# EAGLE design Shruthi-Analog-SVF-v01c (EAGLE 5.09)
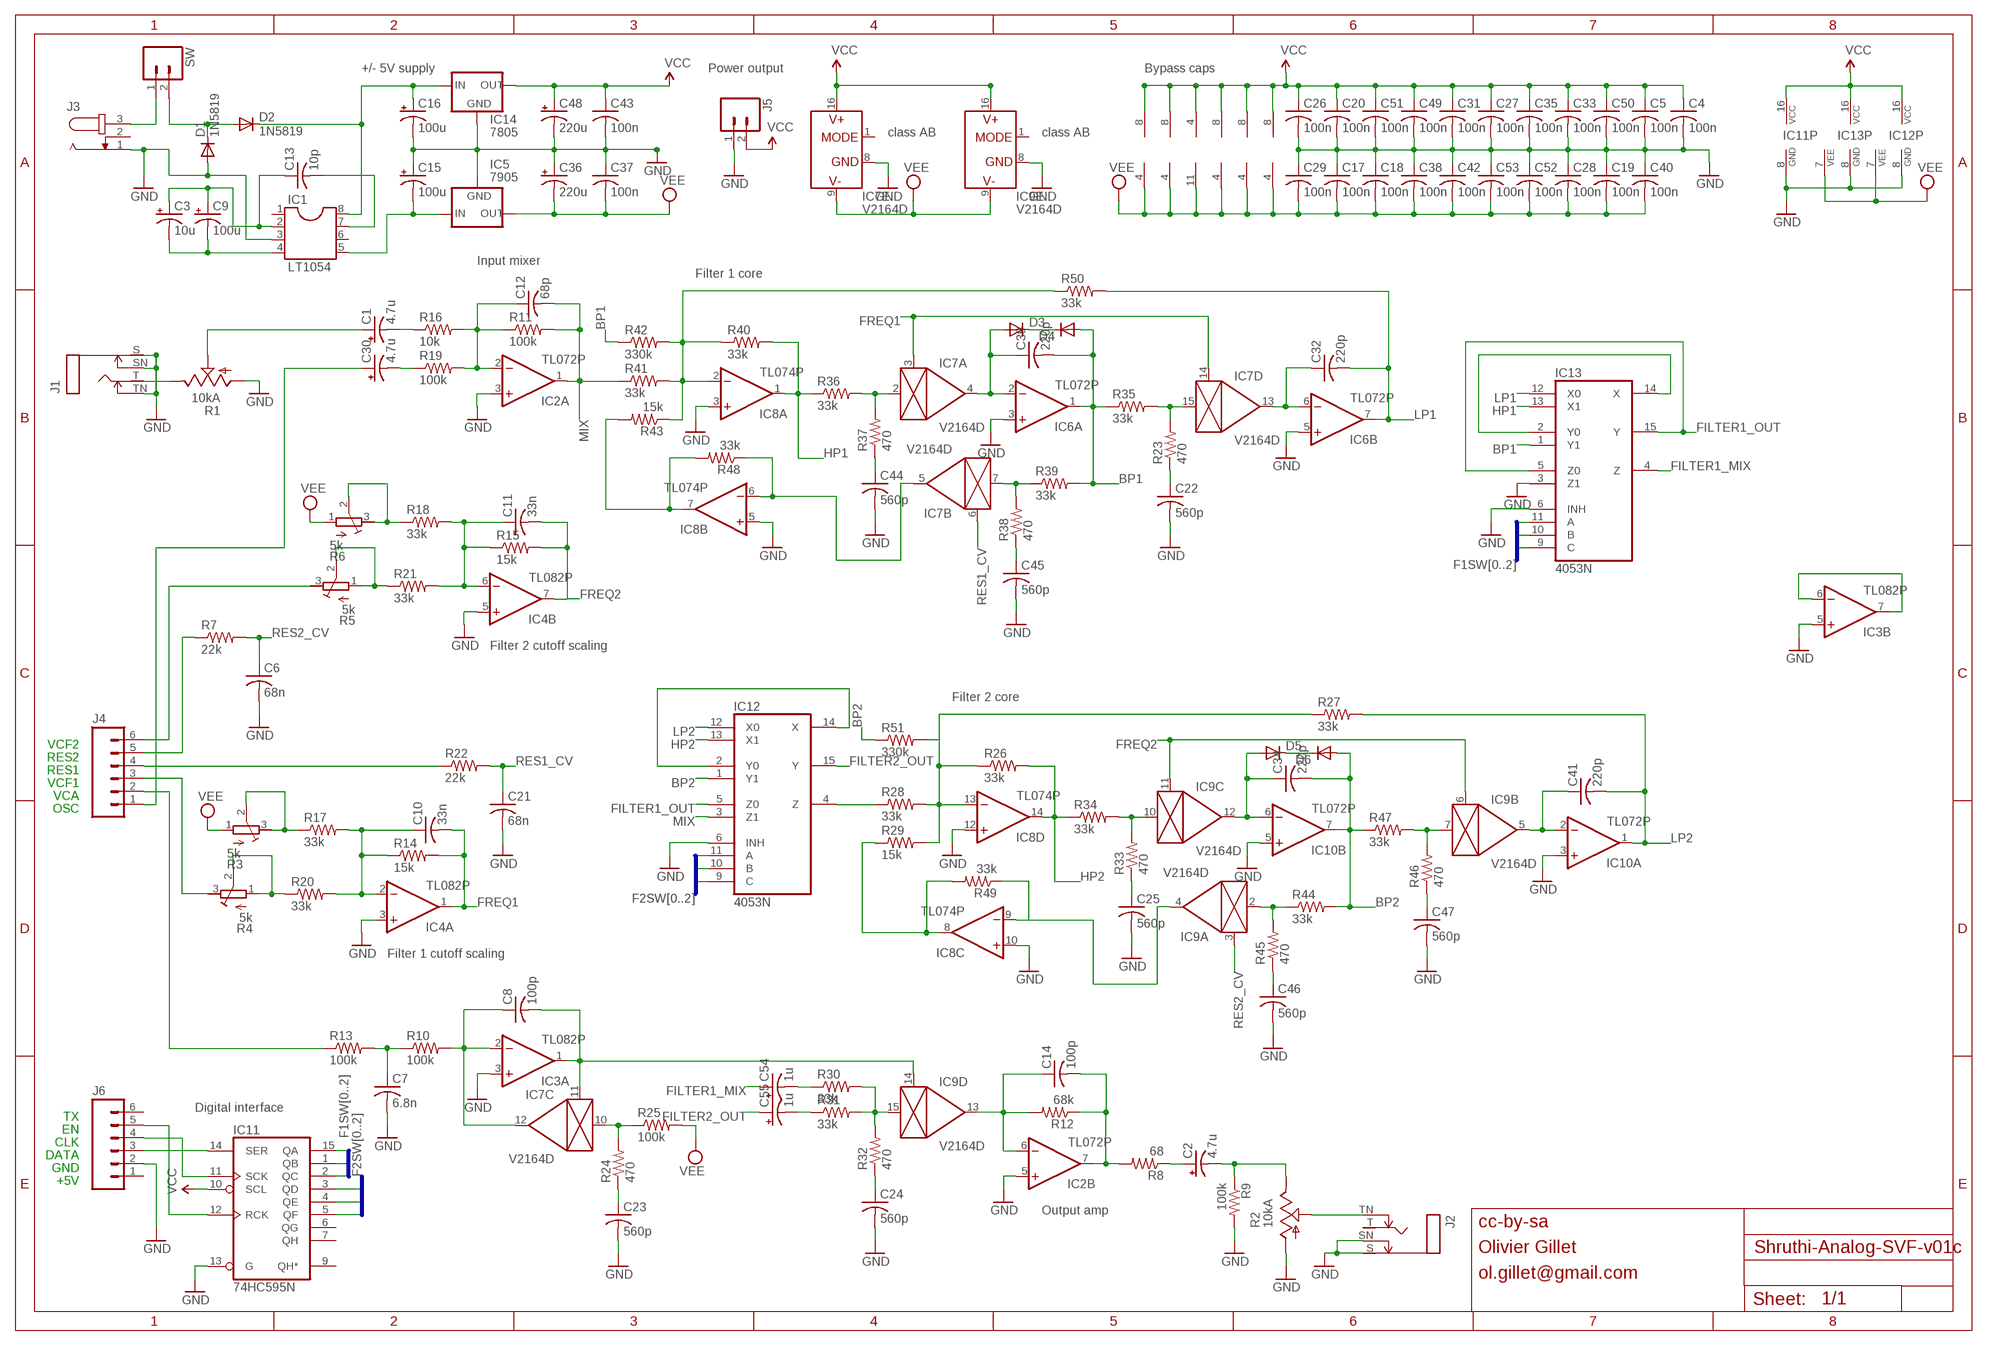
[diagram p0: schematic, sheet 1]

## Parts
C1  4.7u  CPOL-USE2.5-6  [E2,5-6]
C2  4.7u  CPOL-USE2.5-6  [E2,5-6]
C3  10u  CPOL-USE2.5-5  [E2,5-5]
C4  100n  C-US025-025X050  [C025-025X050]
C5  100n  C-US025-025X050  [C025-025X050]
C6  68n  C-US050-025X075  [C050-025X075]
C7  6.8n  C-US025-025X050  [C025-025X050]
C8  100p  C-US025-025X050  [C025-025X050]
C9  100u  CPOL-USE2.5-6  [E2,5-6]
C10  33n  C-US050-025X075  [C050-025X075]
C11  33n  C-US050-025X075  [C050-025X075]
C12  68p  C-US025-025X050  [C025-025X050]
C13  10p  C-US025-025X050  [C025-025X050]
C14  100p  C-US025-025X050  [C025-025X050]
C15  100u  CPOL-USE2.5-7  [E2,5-7]
C16  100u  CPOL-USE2.5-7  [E2,5-7]
C17  100n  C-US025-025X050  [C025-025X050]
C18  100n  C-US025-025X050  [C025-025X050]
C19  100n  C-US025-025X050  [C025-025X050]
C20  100n  C-US025-025X050  [C025-025X050]
C21  68n  C-US050-025X075  [C050-025X075]
C22  560p  C-US025-025X050  [C025-025X050]
C23  560p  C-US025-025X050  [C025-025X050]
C24  560p  C-US025-025X050  [C025-025X050]
C25  560p  C-US025-025X050  [C025-025X050]
C26  100n  C-US025-025X050  [C025-025X050]
C27  100n  C-US025-025X050  [C025-025X050]
C28  100n  C-US025-025X050  [C025-025X050]
C29  100n  C-US025-025X050  [C025-025X050]
C30  4.7u  CPOL-USE2.5-6  [E2,5-6]
C31  100n  C-US025-025X050  [C025-025X050]
C32  220p  C-US025-025X050  [C025-025X050]
C33  100n  C-US025-025X050  [C025-025X050]
C34  220p  C-US025-025X050  [C025-025X050]
C35  100n  C-US025-025X050  [C025-025X050]
C36  220u  CPOL-USE5-10.5  [E5-10,5]
C37  100n  C-US025-025X050  [C025-025X050]
C38  100n  C-US025-025X050  [C025-025X050]
C39  220p  C-US025-025X050  [C025-025X050]
C40  100n  C-US025-025X050  [C025-025X050]
C41  220p  C-US025-025X050  [C025-025X050]
C42  100n  C-US025-025X050  [C025-025X050]
C43  100n  C-US025-025X050  [C025-025X050]
C44  560p  C-US025-025X050  [C025-025X050]
C45  560p  C-US025-025X050  [C025-025X050]
C46  560p  C-US025-025X050  [C025-025X050]
C47  560p  C-US025-025X050  [C025-025X050]
C48  220u  CPOL-USE5-10.5  [E5-10,5]
C49  100n  C-US025-025X050  [C025-025X050]
C50  100n  C-US025-025X050  [C025-025X050]
C51  100n  C-US025-025X050  [C025-025X050]
C52  100n  C-US025-025X050  [C025-025X050]
C53  100n  C-US025-025X050  [C025-025X050]
C54  1u  CPOL-USE2.5-5  [E2,5-5]
C55  1u  CPOL-USE2.5-5  [E2,5-5]
D1  1N5819  1N4004  [DO41-10]
D2  1N5819  1N4004  [DO41-10]
D3  DIODE-D-5  [D-5]
D4  DIODE-D-5  [D-5]
D5  DIODE-D-5  [D-5]
D6  DIODE-D-5  [D-5]
IC1  LT1054  DIL8  [DIL08]
IC2  TL072P  [DIL08]
IC3  TL082P  TL072P  [DIL08]
IC4  TL082P  TL072P  [DIL08]
IC5  7905  79XXS  [79XXS]
IC6  TL072P  [DIL08]
IC7  V2164D  SSM2164P  [DIL16]
IC8  TL074P  [DIL14]
IC9  V2164D  SSM2164P  [DIL16]
IC10  TL072P  [DIL08]
IC11  74HC595N  [DIL16]
IC12  4053N  [DIL16]
IC13  4053N  [DIL16]
IC14  7805  78XXS  [78XXS]
J1  MONOSWS  [NMJ4HC-S]
J2  MONOSWS  [NMJ4HC-S]
J3  JACK-PLUG1  [SPC4078]
J4  M06SIP  [1X06]
J5  M02PTH  [1X02]
J6  M06SIP  [1X06]
R1  10kA  POT_USCABLED  [CABLE_POT_6MM]
R2  10kA  POT_USCABLED  [CABLE_POT_6MM]
R3  5k  R-TRIMM3296W  [RTRIM3296W]
R4  5k  R-TRIMM3296W  [RTRIM3296W]
R5  5k  R-TRIMM3296W  [RTRIM3296W]
R6  5k  R-TRIMM3296W  [RTRIM3296W]
R7  22k  R-US_0204/7  [0204/7]
R8  68  R-US_0204/7  [0204/7]
R9  100k  R-US_0204/7  [0204/7]
R10  100k  R-US_0204/7  [0204/7]
R11  100k  R-US_0204/7  [0204/7]
R12  68k  R-US_0204/7  [0204/7]
R13  100k  R-US_0204/7  [0204/7]
R14  15k  R-US_0204/7  [0204/7]
R15  15k  R-US_0204/7  [0204/7]
R16  10k  R-US_0204/7  [0204/7]
R17  33k  R-US_0204/7  [0204/7]
R18  33k  R-US_0204/7  [0204/7]
R19  100k  R-US_0204/7  [0204/7]
R20  33k  R-US_0204/7  [0204/7]
R21  33k  R-US_0204/7  [0204/7]
R22  22k  R-US_0204/7  [0204/7]
R23  470  R-US_0204/7  [0204/7]
R24  470  R-US_0204/7  [0204/7]
R25  100k  R-US_0204/7  [0204/7]
R26  33k  R-US_0204/7  [0204/7]
R27  33k  R-US_0204/7  [0204/7]
R28  33k  R-US_0204/7  [0204/7]
R29  15k  R-US_0204/7  [0204/7]
R30  33k  R-US_0204/7  [0204/7]
R31  33k  R-US_0204/7  [0204/7]
R32  470  R-US_0204/7  [0204/7]
R33  470  R-US_0204/7  [0204/7]
R34  33k  R-US_0204/7  [0204/7]
R35  33k  R-US_0204/7  [0204/7]
R36  33k  R-US_0204/7  [0204/7]
R37  470  R-US_0204/7  [0204/7]
R38  470  R-US_0204/7  [0204/7]
R39  33k  R-US_0204/7  [0204/7]
R40  33k  R-US_0204/7  [0204/7]
R41  33k  R-US_0204/7  [0204/7]
R42  330k  R-US_0204/7  [0204/7]
R43  15k  R-US_0204/7  [0204/7]
R44  33k  R-US_0204/7  [0204/7]
R45  470  R-US_0204/7  [0204/7]
R46  470  R-US_0204/7  [0204/7]
R47  33k  R-US_0204/7  [0204/7]
R48  33k  R-US_0204/7  [0204/7]
R49  33k  R-US_0204/7  [0204/7]
R50  33k  R-US_0204/7  [0204/7]
R51  330k  R-US_0204/7  [0204/7]
SW  M02PTH  [1X02]

## Nets
BP1: C39.2 D4.A IC6.1(A:OUT) IC13.1(Y1) R35.1 R39.2 R42.1
BP2: C34.2 D6.A IC10.7(B:OUT) IC12.1(Y1) R44.2 R47.1 R51.1
F1SW0: IC11.15(QA) IC13.9(C)
F1SW1: IC11.1(QB) IC13.10(B)
F1SW2: IC11.2(QC) IC13.11(A)
F2SW0: IC11.3(QD) IC12.9(C)
F2SW1: IC11.4(QE) IC12.10(B)
F2SW2: IC11.5(QF) IC12.11(A)
FILTER1_MIX: C54.+ IC13.4(Z)
FILTER1_OUT: IC12.5(Z0) IC13.5(Z0) IC13.15(Y)
FILTER2_OUT: C55.+ IC12.15(Y)
FREQ1: C10.2 IC4.1(A:OUT) IC7.3(A:CTRL) IC7.14(D:CTRL) R14.2
FREQ2: C11.2 IC4.7(B:OUT) IC9.6(B:CTRL) IC9.11(C:CTRL) R15.2
GND: C4.2 C5.2 C6.2 C7.2 C15.+ C16.- C17.1 C18.1 C19.1 C20.2 C21.2 C22.2 C23.2 C24.2 C25.2 C26.2 C27.2 C28.1 C29.1 C31.2 C33.2 C35.2 C36.+ C37.1 C38.1 C40.1 C42.1 C43.2 C44.2 C45.2 C46.2 C47.2 C48.- C49.2 C50.2 C51.2 C52.1 C53.1 D1.A IC1.3 IC2.3(A:+IN) IC2.5(B:+IN) IC3.3(A:+IN) IC3.5(B:+IN) IC4.3(A:+IN) IC4.5(B:+IN) IC5.GND IC6.3(A:+IN) IC6.5(B:+IN) IC7.8(E:GND) IC8.3(A:+IN) IC8.5(B:+IN) IC8.10(C:+IN) IC8.12(D:+IN) IC9.8(E:GND) IC10.3(A:+IN) IC10.5(B:+IN) IC11.8(GND) IC11.13(G) IC12.6(INH) IC12.8(GND) IC13.3(Z1) IC13.6(INH) IC13.8(GND) IC14.GND J1.S J1.SN J1.TN J2.S J2.SN J3.1 J5.1 J6.2 R1.A R2.A R9.2
HP1: IC8.1(A:OUT) IC13.13(X1) R36.1 R40.2
HP2: IC8.14(D:OUT) IC12.13(X1) R26.2 R34.1
LP1: C32.2 IC6.7(B:OUT) IC13.12(X0) R50.2
LP2: C41.2 IC10.1(A:OUT) IC12.12(X0) R27.2
MIX: C12.2 IC2.1(A:OUT) IC12.3(Z1) R11.2 R41.1
N$1: C3.+ C9.+ C13.1 IC1.2
N$2: C11.1 IC4.6(B:-IN) R15.1 R18.2 R21.2
N$3: J3.3 SW.1
N$4: C16.+ D2.C IC1.8 IC14.IN
N$5: C3.- C9.- IC1.4
N$6: C12.1 IC2.2(A:-IN) R11.1 R16.2 R19.2
N$7: R5.1(E) R5.2(S) R21.1
N$8: J4.6 R5.3(A)
N$9: R6.2(S) R6.3(A) R18.1
N$10: IC7.10(C:IN) R24.2 R25.1
N$11: C8.1 IC3.2(A:-IN) IC7.12(C:OUT) R10.2
N$12: IC8.2(A:-IN) R40.1 R41.2 R42.2 R43.1 R50.1
N$13: IC11.12(RCK) J6.5
N$14: IC11.14(SER) J6.3
N$16: IC11.11(SCK) J6.4
N$17: C22.1 R23.1
N$18: IC8.13(D:-IN) R26.1 R27.1 R28.2 R29.2 R51.2
N$19: C39.1 D3.A IC6.2(A:-IN) IC7.4(A:OUT)
N$20: C34.1 D5.A IC9.12(C:OUT) IC10.6(B:-IN)
N$21: IC7.7(B:IN) R38.2 R39.1
N$22: C7.1 R10.1 R13.2
N$23: IC8.8(C:OUT) R29.1 R49.2
N$24: IC9.2(A:IN) R44.1 R45.2
N$25: C2.+ R8.1
N$26: IC7.15(D:IN) R23.2 R35.2
N$27: C45.1 R38.1
N$28: C32.1 IC6.6(B:-IN) IC7.13(D:OUT)
N$29: IC7.2(A:IN) R36.2 R37.2
N$30: C44.1 R37.1
N$31: IC7.5(B:OUT) IC8.6(B:-IN) R48.1
N$32: C2.- R2.E R9.1
N$33: D5.C D6.C
N$34: IC9.7(B:IN) R46.2 R47.2
N$35: C30.+ J4.1
N$36: C13.2 IC1.7
N$37: IC8.9(C:-IN) IC9.4(A:OUT) R49.1
N$38: J1.T R1.E
N$39: C30.- R19.1
N$40: C10.1 IC4.2(A:-IN) R14.1 R17.2 R20.2
N$41: R4.1(E) R4.2(S) R20.1
N$42: J4.3 R4.3(A)
N$43: R3.2(S) R3.3(A) R17.1
N$44: C41.1 IC9.5(B:OUT) IC10.2(A:-IN)
N$45: J4.2 R13.1
N$46: C47.1 R46.1
N$47: J2.TN R2.S
N$48: IC8.7(B:OUT) R43.2 R48.2
N$49: C46.1 R45.1
N$50: IC9.10(C:IN) R33.2 R34.2
N$51: C25.1 R33.1
N$55: D3.C D4.C
N$56: C8.2 IC3.1(A:OUT) IC7.11(C:CTRL) IC9.14(D:CTRL)
N$57: C54.- R30.1
N$58: C15.- IC1.5 IC5.IN
N$59: D1.C D2.A SW.2
N$60: C55.- R31.1
N$61: IC3.6(B:-IN) IC3.7(B:OUT)
N$62: IC13.2(Y0) IC13.14(X)
N$63: C14.2 IC2.7(B:OUT) R8.2 R12.1
N$64: C23.1 R24.1
N$65: C24.1 R32.1
N$66: C1.+ R1.S
N$67: IC9.15(D:IN) R30.2 R31.2 R32.2
N$69: J4.4 R22.1
N$70: C14.1 IC2.6(B:-IN) IC9.13(D:OUT) R12.2
N$72: C1.- R16.1
N$73: J4.5 R7.1
N$74: IC12.2(Y0) IC12.14(X)
N$75: IC12.4(Z) R28.1
RES1_CV: C21.1 IC7.6(B:CTRL) R22.2
RES2_CV: C6.1 IC9.3(A:CTRL) R7.2
VCC: C4.1 C5.1 C20.1 C26.1 C27.1 C31.1 C33.1 C35.1 C43.1 C48.+ C49.1 C50.1 C51.1 IC2.8(P:V+) IC3.8(P:V+) IC4.8(P:V+) IC6.8(P:V+) IC7.16(E:V+) IC8.4(P:V+) IC9.16(E:V+) IC10.8(P:V+) IC11.10(SCL) IC11.16(VCC) IC12.16(VCC) IC13.16(VCC) IC14.OUT J5.2
VEE: C17.2 C18.2 C19.2 C28.2 C29.2 C36.- C37.2 C38.2 C40.2 C42.2 C52.2 C53.2 IC2.4(P:V-) IC3.4(P:V-) IC4.4(P:V-) IC5.OUT IC6.4(P:V-) IC7.9(E:V-) IC8.11(P:V-) IC9.9(E:V-) IC10.4(P:V-) IC12.7(VEE) IC13.7(VEE) R3.1(E) R6.1(E) R25.2
Unconnected: IC1.1 IC1.6 IC7.1(E:MODE) IC9.1(E:MODE) IC11.6(QG) IC11.7(QH) IC11.9(QH*) J2.T J3.2 J6.1 J6.6

## Buses
F1SW[0..2]
F2SW[0..2]

## Notes on the sheet
- +/- 5V supply | Power output | Bypass caps
- class AB | class AB
- Input mixer
- Filter 1 core
- Filter 2 cutoff scaling
- Filter 2 core
- VCF2
- RES2
- RES1
- VCF1
- VCA
- OSC
- Filter 1 cutoff scaling
- TX | Digital interface
- EN
- CLK
- DATA
- GND
- +5V
- Output amp
- cc-by-sa
- Olivier Gillet
- ol.gillet@gmail.com

## Library data of the parts
C1-C3 C9 C15 C16 C30 C36 C48 C54 C55 = rcl:CPOL-US: POLARIZED CAPACITOR, American symbol
C4-C8 C10-C14 C17-C29 C31-C35 C37-C47 C49-C53 = rcl:C-US: CAPACITOR, American symbol
D1 D2 = diode:1N4004: DIODE general purpose rectifier, 1 A
D3-D6 = diode:DIODE-: DIODE
IC1 = ic-package:DIL8: Dual In Line / Socket
IC2-IC4 IC6 IC10 = gm-ics:TL072: OP AMP
IC5 = v-reg:79XXS: VOLTAGE REGULATOR
IC7 IC9 = ssm2164:SSM2164
IC8 = linear:TL074: OP AMP
IC11 = 74xx-eu:74*595: 8-bit SHIFT REGISTER, output latch
IC12 IC13 = 40xx:4053: Triple 2-channel ANALOG MULTIPLEXER
IC14 = v-reg:78XXS: VOLTAGE REGULATOR
J1 J2 = gm-jacks:MONOSW
J3 = con-jack2:JACK-PLUG: DC POWER JACK Power Jack, DC, Right Angle, Through Hole, Rated 5A at 16VDC, PC Terminals Distributor: Farnell (www.Farnell.de) Drawing: 84N1161.pdf / 84N1162.pdf Manufacturer: SPC Technology (www.spctechnology.com) Type: SPC4077 / SPC 4078
J4 J6 = SparkFun:M06: Header 6 Standard 6-pin 0.1" header. Use with straight break away headers (SKU : PRT-00116), right angle break away headers (PRT-00553), swiss pins (PRT-00743), machine pins (PRT-00117), and female headers (PRT-00115). Molex polarized connector foot print use with SKU : PRT-08094 with associated crimp pins and housings. NOTES ON THE VARIANTS LOCK and LOCK_LONGPADS... This footprint was designed to help hold the alignment of a through-hole component (i.e. 6-pin header) while soldering it into place. You may notice that each hole has been shifted either up or down by 0.005 of an inch from it's more standard position (which is a perfectly straight line). This slight alteration caused the pins (the squares in the middle) to touch the edges of the holes. Because they are alternating, it causes a "brace" to hold the component in place. 0.005 has proven to be the perfect amount of "off-center" position when using our standard breakaway headers. Although looks a little odd when you look at the bare footprint, once you have a header in there, the alteration is very hard to notice. Also, if you push a header all the way into place, it is covered up entirely on the bottom side. This idea of altering the position of holes to aid alignment will be further integrated into the Sparkfun Library for other footprints. It can help hold any component with 3 or more connection pins.
J5 SW = SparkFun:M02: Header 2 Standard 2-pin 0.1" header. Use with straight break away headers (SKU : PRT-00116), right angle break away headers (PRT-00553), swiss pins (PRT-00743), machine pins (PRT-00117), and female headers (PRT-00115). Molex polarized connector foot print use with SKU : PRT-08233 with associated crimp pins and housings.
R1 R2 = pot-cable:POT_US
R3-R6 = rcl:R-TRIMM: Trimm resistor
R7-R51 = rcl:R-US_: RESISTOR, American symbol

## Board
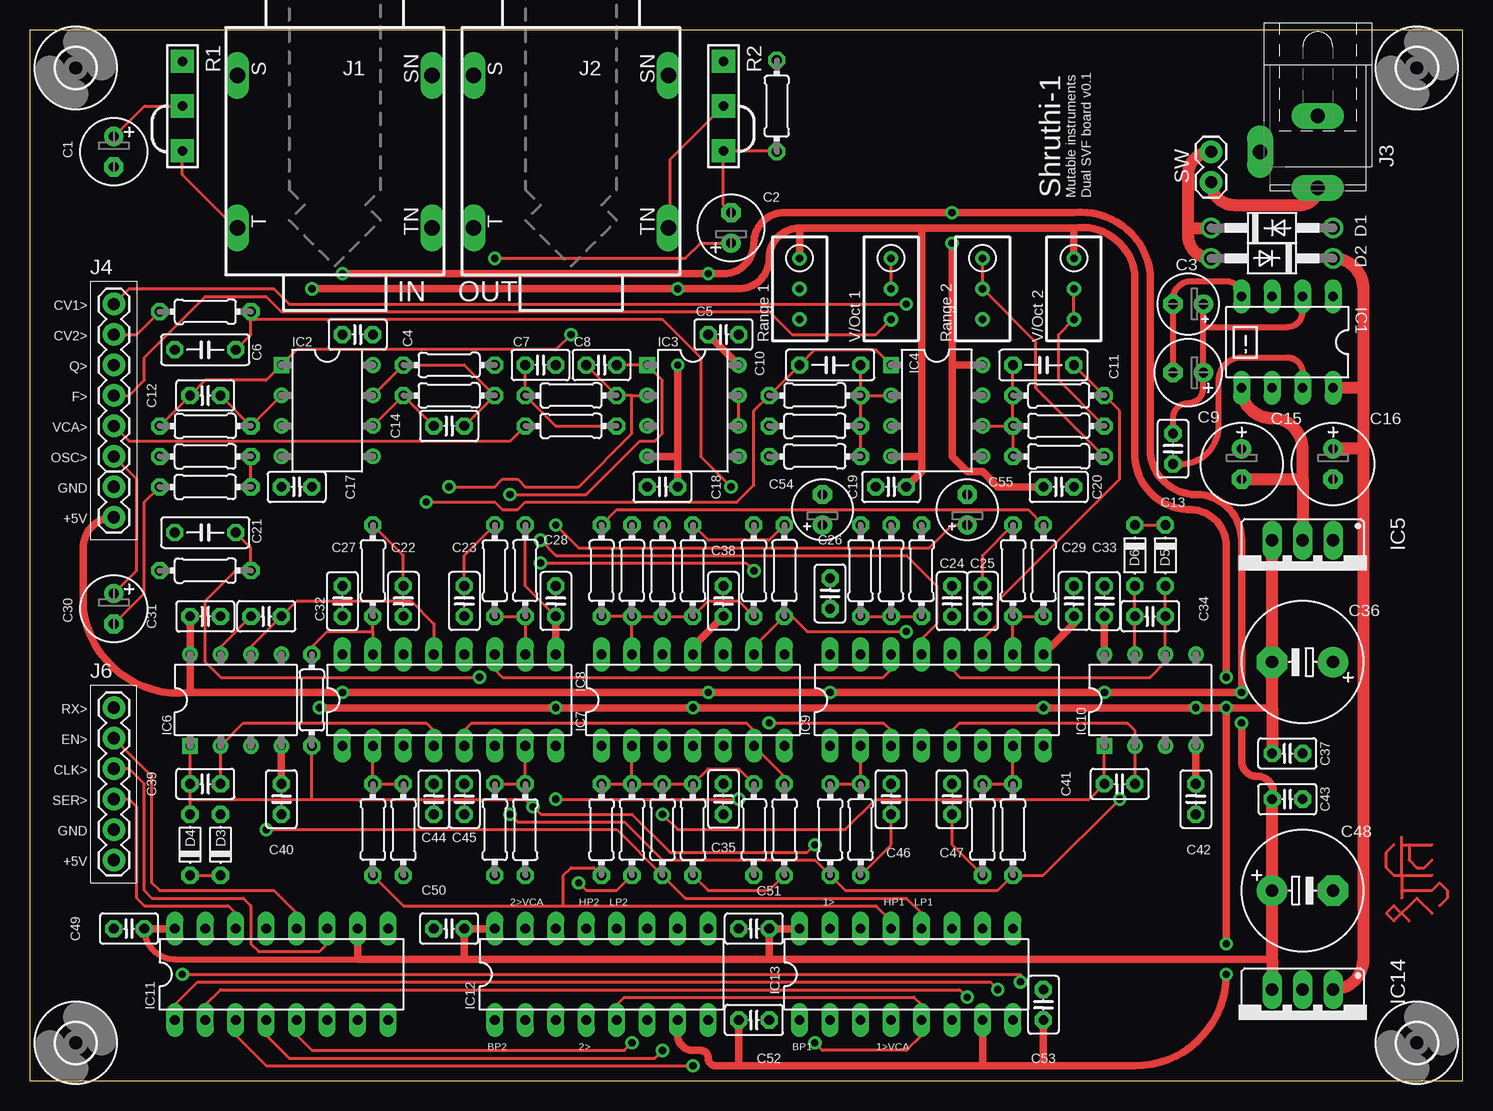
[diagram p1: board, top side]
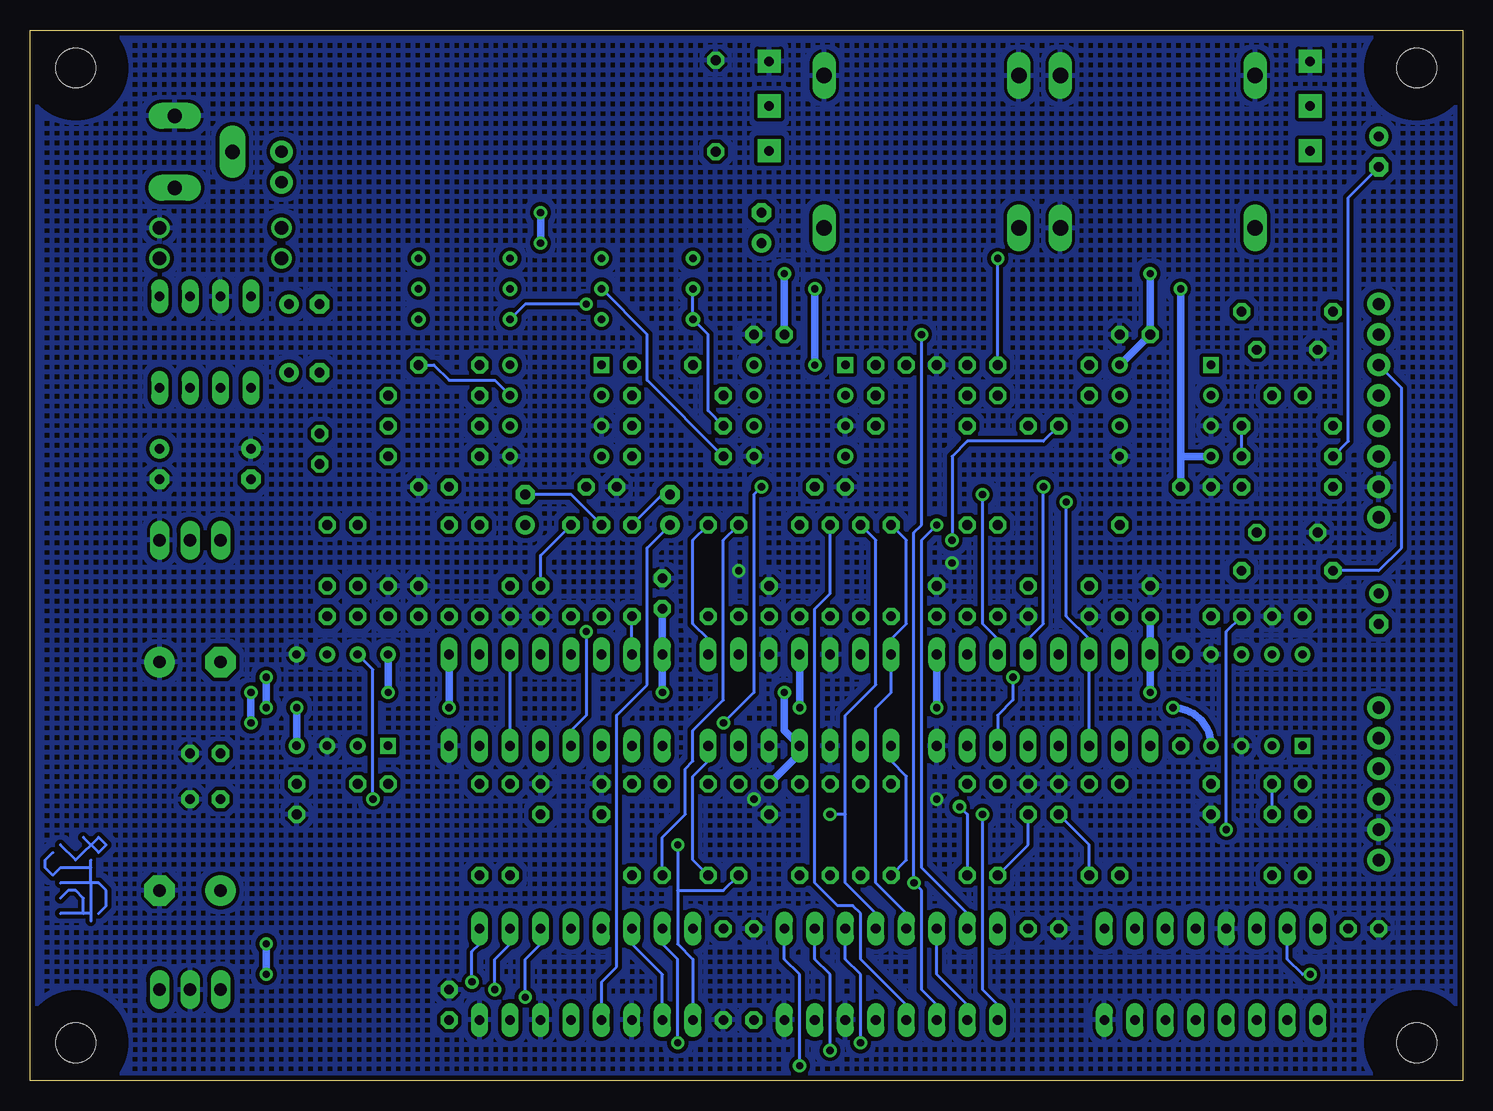
[diagram p2: board, bottom side, seen from below]

Size 119.38 x 87.62 mm. Coordinates in mm from the lower left corner, seen from the top.
Outline: 0,0 119.38,0 119.38,87.62 0,87.62 0,0
Copper layers (1*16): Top 0.035mm / dielectric 1.5mm / Bottom 0.035mm
Design rules "SparkFun_10mil *": minimum track width 10mil, minimum drill 20mil, track to track 10mil, track to pad 10mil, pad to pad 10mil, via to via 10mil, smd to smd 10mil, copper to edge 10mil, drill to drill 10mil, minimum pad ring 12mil, minimum via ring 10mil, stop-mask expansion 4mil, vias tented up to drill 25mil, thermal gap 10mil

### Footprints (pad centres in the part's own frame; a part is rotated, then mirrored left to right if it is on the bottom)
E2,5-6 = drill 0.813 pad 1.6 round: + -1.27,0 | drill 0.813 pad 1.6 octagon: - 1.27,0
E2,5-5 = drill 0.813 pad 1.6 round: + -1.27,0 | drill 0.813 pad 1.6 octagon: - 1.27,0
C025-025X050 = drill 0.813 octagon: 1 -1.27,0; 2 1.27,0
C050-025X075 = drill 0.813 octagon: 1 -2.54,0; 2 2.54,0
E2,5-7 = drill 0.813 pad 1.6 round: + -1.27,0 | drill 0.813 pad 1.6 octagon: - 1.27,0
E5-10,5 = drill 1.016 pad 2.54 round: + -2.54,0 | drill 1.016 pad 2.54 octagon: - 2.54,0
DO41-10 = drill 1.118 round: A 5.08,0; C -5.08,0
D-5 = drill 0.813 octagon: A 2.54,0; C -2.54,0
DIL08 = drill 0.813 long: 1 -3.81,-3.81; 2 -1.27,-3.81; 3 1.27,-3.81; 4 3.81,-3.81; 5 3.81,3.81; 6 1.27,3.81; 7 -1.27,3.81; 8 -3.81,3.81
DIL08' = drill 0.7 square: 1 -3.81,-3.81 | drill 0.7 round: 2 -1.27,-3.81; 3 1.27,-3.81; 4 3.81,-3.81; 5 3.81,3.81; 6 1.27,3.81; 7 -1.27,3.81; 8 -3.81,3.81
79XXS = drill 1.016 long: GND -2.54,-2.54; IN 0,-2.54; OUT 2.54,-2.54
DIL16 = drill 0.813 long: 1 -8.89,-3.81; 2 -6.35,-3.81; 3 -3.81,-3.81; 4 -1.27,-3.81; 5 1.27,-3.81; 6 3.81,-3.81; 7 6.35,-3.81; 8 8.89,-3.81; 9 8.89,3.81; 10 6.35,3.81; 11 3.81,3.81; 12 1.27,3.81; 13 -1.27,3.81; 14 -3.81,3.81; 15 -6.35,3.81; 16 -8.89,3.81
DIL14 = drill 0.813 long: 1 -7.62,-3.81; 2 -5.08,-3.81; 3 -2.54,-3.81; 4 0,-3.81; 5 2.54,-3.81; 6 5.08,-3.81; 7 7.62,-3.81; 8 7.62,3.81; 9 5.08,3.81; 10 2.54,3.81; 11 0,3.81; 12 -2.54,3.81; 13 -5.08,3.81; 14 -7.62,3.81
78XXS = drill 1.016 long: GND 0,-2.54; IN -2.54,-2.54; OUT 2.54,-2.54
NMJ4HC-S = drill 1.3 long: S 5.08,8.115; SN 5.08,-8.115; T -7.62,8.115; TN -7.62,-8.115
SPC4078_LARGER_HOLES = drill 1.2 pad 2.184 long: 1 -3,0; 2 0,-4.8; 3 3,0
1X06 = drill 1.016 pad 1.88 round: 1 0,0; 2 2.54,0; 3 5.08,0; 4 7.62,0; 5 10.16,0; 6 12.7,0
1X02 = drill 1.016 pad 1.88 round: 1 0,0; 2 2.54,0
CABLE_POT_6MM = drill 0.8 pad 1.93 square: A -3.73,0; E 3.73,0; S 0,0
RTRIM3296W = drill 0.61 round: 1 0,-2.54; 2 0,0; 3 0,2.54
0204/7 = drill 0.813 octagon: 1 -3.81,0; 2 3.81,0
3,3 = hole 3.3: 0,0

### Placement (x,y rotation side)
C1  6.99,77.47 270 top
C2  58.42,71.12 90 top
C3  96.52,64.77 180 top
C4  27.3,62.23 0 top
C5  57.78,62.23 0 top
C6  14.61,60.96 180 top
C7  42.55,59.69 0 top
C8  47.62,59.69 0 top
C9  96.52,59.05 180 top
C10  66.67,59.69 180 top
C11  84.45,59.69 0 top
C12  14.61,57.15 180 top
C13  95.25,52.71 270 top
C14  34.93,54.61 0 top
C15  100.97,51.44 270 top
C16  108.58,51.44 270 top
C17  22.23,49.53 0 top
C18  52.7,49.53 0 top
C19  71.75,49.53 0 top
C20  85.72,49.53 0 top
C21  14.61,45.72 180 top
C22  31.11,40.01 270 top
C23  36.2,40.01 270 top
C24  76.83,40.01 270 top
C25  79.38,40.01 270 top
C26  66.67,40.64 90 top
C27  26.04,40.01 90 top
C28  43.81,40.01 270 top
C29  87,40.01 270 top
C30  6.99,39.37 270 top
C31  14.61,38.73 0 top
C32  19.68,38.73 180 top
C33  89.53,40.01 90 top
C34  93.34,38.73 180 top
C35  57.78,23.49 270 top
C36  106.05,34.92 180 top
C37  104.78,27.3 180 top
C38  57.78,40.01 270 top
C39  14.61,24.76 180 top
C40  20.96,23.49 90 top
C41  90.8,24.76 180 top
C42  97.16,23.49 90 top
C43  104.78,23.49 0 top
C44  33.66,23.49 90 top
C45  36.2,23.49 90 top
C46  71.75,23.49 90 top
C47  76.83,23.49 90 top
C48  106.05,15.88 0 top
C49  8.26,12.7 180 top
C50  34.93,12.7 180 top
C51  60.33,12.7 180 top
C52  60.33,5.08 180 top
C53  84.45,6.35 270 top
C54  66.04,47.62 90 top
C55  78.11,47.62 90 top
D1  103.5,71.12 0 top
D2  103.5,68.58 180 top
D3  15.88,19.68 90 top
D4  13.34,19.68 90 top
D5  94.61,43.82 270 top
D6  92.08,43.82 270 top
IC1  104.78,61.59 180 top
IC2  TL072P  [DIL08']  24.77,55.88 270 top
IC3  TL082P  [DIL08']  55.24,55.88 270 top
IC4  TL082P  [DIL08']  75.56,55.88 270 top
IC5  106.05,42.55 180 top
IC6  TL072P  [DIL08']  17.14,31.75 0 top
IC7  34.93,31.75 0 top
IC8  55.24,31.75 0 top
IC9  75.56,31.75 0 top
IC10  TL072P  [DIL08']  93.34,31.75 0 top
IC11  20.96,8.89 0 top
IC12  47.62,8.89 0 top
IC13  73.03,8.89 0 top
IC14  106.05,5.08 180 top
J1  25.4,78.74 90 top
J2  45.09,78.74 90 top
J3  [SPC4078_LARGER_HOLES]  107.31,77.47 270 top
J4  6.99,52.07 90 top
J5  6.99,49.53 270 top
J6  6.99,18.41 90 top
R1  12.7,81.28 270 top
R2  57.78,81.28 270 top
R3  64.14,66.04 180 top
R4  71.75,66.04 180 top
R5  79.38,66.04 180 top
R6  87,66.04 180 top
R7  14.61,64.14 0 top
R8  34.93,59.69 180 top
R9  62.23,81.28 90 top
R10  45.09,57.15 0 top
R11  14.61,54.61 180 top
R12  34.93,57.15 180 top
R13  45.09,54.61 0 top
R14  65.41,57.15 180 top
R15  85.72,57.15 0 top
R16  14.61,52.07 0 top
R17  65.41,54.61 0 top
R18  85.72,54.61 180 top
R19  14.61,49.53 0 top
R20  65.41,52.07 0 top
R21  85.72,52.07 180 top
R22  14.61,42.55 0 top
R23  28.57,42.55 270 top
R24  38.73,42.55 270 top
R25  41.27,42.55 90 top
R26  47.62,42.55 90 top
R27  50.16,42.55 90 top
R28  52.7,42.55 270 top
R29  55.24,42.55 270 top
R30  69.22,42.55 270 top
R31  71.75,42.55 270 top
R32  74.3,42.55 270 top
R33  81.92,42.55 270 top
R34  84.45,42.55 270 top
R35  23.5,31.75 90 top
R36  28.57,20.95 90 top
R37  31.11,20.95 90 top
R38  38.73,20.95 90 top
R39  41.27,20.95 270 top
R40  47.62,20.95 270 top
R41  50.16,20.95 90 top
R42  60.33,20.95 90 top
R43  55.24,20.95 270 top
R44  66.67,20.95 270 top
R45  69.22,20.95 90 top
R46  79.38,20.95 90 top
R47  81.92,20.95 90 top
R48  62.87,20.95 270 top
R49  62.87,42.55 90 top
R50  52.7,20.95 270 top
R51  60.33,42.55 270 top
SW  98.42,74.93 90 top
U$1  [DURGA]  83.82,73.03 90 top
U$2  [3,3]  3.81,84.45 0 top
U$3  [3,3]  115.57,84.45 0 top
U$4  [3,3]  3.81,3.17 0 top
U$5  [3,3]  115.57,3.17 0 top
U$6  [DURGA]  85.09,3.81 0 top

### Tracks (layer width: path | path; a pad name or v marks a point on that pad's centre or on a via)
BP1  (via drill 0.6)
  Top 0.254: IC6.1 C39.2 13.34,23.49 | 23.5,23.49 R35.1 | 13.34,23.49 23.5,23.49 | 23.5,23.49 41.27,23.49 v41.91,22.86 42.55,22.22 50.16,22.22 53.34,19.05 64.77,19.05 v65.41,19.68 | D4.A 13.34,23.49
  Bottom 0.254: v65.41,19.68 65.41,15.88 | 65.41,15.88 65.41,11.43 64.14,10.16 IC13.1 | R39.2 41.27,22.22 v41.91,22.86 | R42.1 61.59,15.88 65.41,15.88
BP2  (via drill 0.6)
  Top 0.254: IC10.7 C34.2 D6.A | v90.8,23.49 84.45,17.14 R47.1 80.64,15.88 67.95,15.88 R44.2 65.41,18.41 52.7,18.41 49.53,21.59 40.64,21.59 v40.01,22.22
  Bottom 0.254: IC10.7 90.8,34.29 v90.8,23.49 | IC12.1 38.73,6.35 40.01,7.62 v40.01,22.22 | R51.1 61.59,45.09 61.59,31.75 64.14,29.21 64.14,26.67 64.77,26.04 64.77,22.22 66.67,20.32 R44.2
F1SW0  (via drill 0.6)
  Top 0.254: v12.7,8.89 82.55,8.89 v82.55,8.26
  Bottom 0.254: IC13.9 81.92,11.43 82.55,10.79 v82.55,8.26 | IC11.15 14.61,10.16 13.34,8.89 v12.7,8.89
F1SW1  (via drill 0.6)
  Top 0.254: IC11.1 12.07,6.35 13.97,8.26 80.01,8.26 v80.64,7.62
  Bottom 0.254: IC13.10 79.38,11.43 80.64,10.16 v80.64,7.62
F1SW2  (via drill 0.6)
  Top 0.254: IC11.2 14.61,6.35 15.88,7.62 77.47,7.62 v78.11,6.98
  Bottom 0.254: v78.11,6.98 78.11,10.16 76.83,11.43 IC13.11
F2SW0  (via drill 0.6)
  Top 0.254: IC11.3 17.14,3.81 19.68,1.27 v55.24,1.27
  Bottom 0.254: v55.24,1.27 55.24,8.89 56.52,10.16 IC12.9
F2SW1  (via drill 0.6)
  Top 0.254: IC11.4 19.68,3.81 21.59,1.91 52.07,1.91 v52.7,2.54
  Bottom 0.254: v52.7,2.54 52.7,8.89 53.98,10.16 IC12.10
F2SW2  (via drill 0.6)
  Top 0.254: IC11.5 22.23,3.81 23.5,2.54 49.53,2.54 v50.16,3.17
  Bottom 0.254: v50.16,3.17 50.16,8.89 51.44,10.16 IC12.11
FILTER1_MIX
  Bottom 0.254: IC13.4 71.75,8.26 70.48,9.53 70.48,30.48 67.95,33.02 67.95,44.45 C54.+
FILTER1_OUT  (via drill 0.6)
  Top 0.254: v65.41,3.17 66.04,2.54 73.03,2.54 74.3,3.81 IC13.5 74.3,6.35 73.66,6.98 49.53,6.98 48.89,6.35 IC12.5
  Bottom 0.254: IC13.15 66.67,11.43 65.41,10.16 v65.41,3.17
FILTER2_OUT  (via drill 0.6)
  Top 0.254: v43.81,46.36 45.72,44.45 74.93,44.45 76.83,46.36 C55.+
  Bottom 0.254: IC12.15 41.27,13.97 45.09,17.78 45.09,45.09 v43.81,46.36
FREQ1  (via drill 0.6)
  Top 0.254: IC4.1 70.48,60.96 65.41,60.96 C10.2 R14.2 60.33,55.88 60.33,49.68 58.91,48.26 41.27,48.26 40.64,47.62 39.37,47.62 38.73,48.26 v33.02,48.26
  Bottom 0.254: IC7.3 IC7.14 31.11,36.83 33.02,38.73 v33.02,48.26
FREQ2
  Top 0.254: C11.2 R15.2 90.8,55.88 90.8,50.16 80.64,40.01 80.64,38.1 79.38,36.83 IC9.11
  Bottom 0.254: IC9.6 IC9.11 | IC4.7 80.64,58.42 84.45,58.42 85.72,59.69 C11.2
GND  (via drill 0.6)
  Top 0.254: v42.55,43.18 59.69,43.18 v60.33,42.55 | v43.81,23.49 v59.05,23.49
  pour Bottom (isolate 0.305, hatched): 0.64,87 0.64,0.64 118.75,0.64 118.75,87
HP1
  Top 0.254: R36.1 31.11,14.61 44.45,14.61 | 44.45,14.61 70.48,14.61 71.75,13.34 IC13.13 | 44.45,14.61 44.45,17.14 45.09,17.78 46.99,17.78 R40.2
  Bottom 0.254: IC8.1 47.62,26.67 46.35,25.4 46.35,18.41 R40.2
HP2
  Top 0.254: R34.1 83.19,47.62 48.89,47.62 R26.2
  Bottom 0.254: IC12.13 46.35,13.97 48.89,16.51 48.89,31.11 47.62,32.38 IC8.14 47.62,36.83 46.35,38.1 46.35,45.09 R26.2
LP1  (via drill 0.6)
  Top 0.254: IC6.7 15.88,36.2 C32.2 | IC13.12 74.3,13.97 73.03,15.24 54.61,15.24 R50.2 48.89,20.95 v19.68,20.95
  Bottom 0.254: C32.2 19.68,37.47 v19.68,20.95
LP2  (via drill 0.6)
  Top 0.254: IC10.1 C41.2 88.27,23.49 70.48,23.49 67.95,20.95 53.98,20.95 v52.7,22.22
  Bottom 0.254: IC12.12 48.89,13.97 51.44,16.51 51.44,22.22 | 51.44,22.22 51.44,30.48 48.89,33.02 48.89,45.09 R27.2 | 51.44,22.22 v52.7,22.22
MIX  (via drill 0.6)
  Top 0.254: R11.2 C12.2 14.61,58.42 19.68,58.42 IC2.1 22.23,60.96 43.81,60.96 v45.09,62.23 | R41.1 48.89,15.88 46.35,15.88 v45.72,16.51
  Bottom 0.254: v45.09,62.23 45.09,46.36 45.72,45.72 v45.72,16.51 45.09,15.88 45.09,7.62 43.81,6.35 IC12.3
N$1
  Top 0.508: 97.79,62.87 C9.+ 97.79,57.79 arc-90 96.52,56.52 arc90 95.25,55.25 C13.1 | 97.79,62.87 C3.+ | IC1.2 106.05,64.14 arc-90 104.78,62.87 97.79,62.87
N$2
  Top 0.254: C11.1 R15.1 R18.2 | R18.2 R21.2 | IC4.6 R18.2
N$3
  Top 1.016: J3.3 arc-90 105.87,73.03 100.33,73.03 arc-90 SW.1
N$4
  Top 1.016: IC14.IN arc90 111.12,10.16 111.12,52.71 | D2.C arc-90 111.12,66.04 111.12,57.79 | 111.12,52.71 111.12,57.79 | 111.12,57.79 IC1.8 | 111.12,52.71 C16.+
N$5
  Top 0.508: IC1.4 arc90 99.69,66.67 96.52,66.67 arc90 C3.- C9.-
N$6
  Top 0.254: C12.1 R11.1 IC2.2 | R19.2 R16.2
  Bottom 0.254: R16.2 R11.1
N$7
  Top 0.254: R5.1 R5.2 83.82,61.59 83.82,57.79 R21.1
N$8  (via drill 0.6)
  Top 0.254: J4.6 8.26,66.04 20.32,66.04 21.59,64.77 v73.03,64.77
  Bottom 0.254: v73.03,64.77 78.11,64.77 R5.3
N$9
  Top 0.254: R6.2 R6.3 85.72,62.23 85.72,58.42 R18.1
N$10
  Top 0.254: IC7.10 R25.1 R24.2
N$11  (via drill 0.6)
  Top 0.254: C8.1 R10.2 50.16,57.15 | 50.16,57.15 IC3.2 | v34.93,49.53 38.73,49.53 39.37,50.16 40.64,50.16 41.27,49.53 45.72,49.53 50.16,53.98 50.16,57.15
  Bottom 0.254: v34.93,49.53 34.93,38.1 36.2,36.83 IC7.12
N$12
  Top 0.254: R41.2 R50.1 R43.1 56.52,26.04 59.05,26.04 R42.2 | R40.1 R41.2 | R41.2 IC8.2
N$13
  Top 0.254: J6.5 7.62,28.57 7.62,27.94 10.16,25.4 10.16,16.51 10.79,15.88 20.32,15.88 22.23,13.97 IC11.12
N$14
  Top 0.254: J6.3 8.26,23.49 8.89,22.86 8.89,15.24 9.53,14.61 16.51,14.61 17.14,13.97 IC11.14
N$15
  Bottom 0.254: 116.84,19.68 115.57,18.41 113.67,20.32 113.03,19.68 113.67,19.05 114.94,20.32
N$16
  Top 0.254: J6.4 8.26,26.04 9.53,24.76 9.53,15.88 10.16,15.24 17.78,15.24 18.41,14.61 18.41,11.43 19.05,10.79 24.13,10.79 24.77,11.43 IC11.11
N$17
  Top 0.254: C22.1 31.11,43.82 R23.1
N$18
  Top 0.254: R27.1 R26.1 | R27.1 R28.2 R29.2 56.52,40.01 59.05,40.01 R51.2 | IC8.13 R27.1
N$19
  Top 0.254: C39.1 IC6.2 17.78,29.84 33.02,29.84 33.66,29.21 IC7.4
  Bottom 0.254: D3.A C39.1
N$20
  Top 0.254: IC9.12 76.83,34.29 77.47,33.66 93.34,33.66 94.61,34.92 IC10.6 C34.1 D5.A
N$21
  Top 0.254: R38.2 R39.1 IC7.7
N$22
  Top 0.254: C7.1 R10.1 43.81,54.61 R13.2
N$23
  Top 0.254: R29.1 56.52,45.09 61.59,45.09 R49.2
  Bottom 0.254: R49.2 64.14,45.09 64.14,38.1 62.87,36.83 IC8.8
N$24
  Top 0.254: IC9.2 R45.2 R44.1
N$25  (via drill 0.6)
  Top 0.254: C2.+ 55.88,69.85 54.61,68.58 v38.73,68.58
  Bottom 0.254: R8.1 v38.73,68.58
N$26
  Top 0.254: R35.2 23.5,36.2 24.77,37.47 28.57,37.47 | 28.57,37.47 R23.2 | 28.57,37.47 IC7.15
N$27
  Bottom 0.254: C45.1 36.2,19.68 R38.1
N$28
  Top 0.254: IC6.6 18.41,36.2 C32.1 22.23,40.01 31.75,40.01 33.66,38.1 IC7.13
N$29
  Top 0.254: R37.2 R36.2 IC7.2
N$30
  Bottom 0.254: R37.1 31.11,19.68 C44.1
N$31
  Top 0.254: R48.1 62.87,25.4 IC8.6 60.33,29.21 59.69,29.84 36.83,29.84 36.2,29.21 IC7.5
N$32
  Top 0.254: C2.- 57.78,73.03 R2.E 62.15,77.55 R9.1
N$33
  Top 0.254: D6.C D5.C
N$34
  Top 0.254: R46.2 R47.2 IC9.7
N$35
  Top 0.254: J4.1 8.89,50.16 8.89,42.55 C30.+
N$36
  Top 0.508: C13.2 95.89,51.44 arc90 99.06,54.61 99.06,58.42 arc-90 100.97,60.33 104.78,60.33 arc-90 106.05,59.05 IC1.7
N$37  (via drill 0.6)
  Top 0.254: IC8.9 60.33,36.2 R49.1 63.5,38.73 64.77,37.47 v73.03,37.47
  Bottom 0.254: v73.03,37.47 73.03,30.48 74.3,29.21 IC9.4
N$38
  Top 0.254: R1.E 12.7,75.56 17.14,71.12 J1.T
N$39
  Top 0.254: C30.- 9.53,40.64 9.53,48.26 R19.1
N$40
  Top 0.254: R20.2 R17.2 R14.1 | R14.1 IC4.2 | R14.1 C10.1
N$41
  Top 0.254: R4.2 R4.1
  Bottom 0.254: R4.2 67.95,62.23 67.95,58.42 R20.1
N$42
  Top 0.254: J4.3 8.26,57.15 9.53,58.42 9.53,60.33 14.61,65.41 19.68,65.41 20.96,64.14 61.59,64.14 63.5,62.23 70.48,62.23 R4.3
N$43
  Bottom 0.254: R3.2 R3.3 62.87,62.23 62.87,55.88 R17.1
N$44
  Top 0.254: C41.1 IC10.2 92.08,29.21 91.44,29.84 77.47,29.84 76.83,29.21 IC9.5
N$45
  Top 0.254: J4.2 8.26,53.34 40.01,53.34 R13.1
N$46
  Top 0.254: R46.1 76.83,19.68 C47.1
N$47
  Top 0.254: J2.TN 53.34,71.12 53.34,76.84 R2.S
N$48
  Top 0.254: R43.2 56.52,15.88 61.59,15.88 R48.2
  Bottom 0.254: IC8.7 62.87,26.67 64.14,25.4 64.14,18.41 R48.2
N$49
  Top 0.254: R45.1 71.75,19.68 C46.1
N$50
  Top 0.254: R34.2 R33.2 IC9.10
N$51
  Top 0.254: R33.1 79.38,43.82 C25.1
N$52
  Bottom 0.254: 114.3,17.78 114.3,18.41 | 114.3,16.51 114.3,17.78 | 114.3,16.51 114.3,13.97 | 114.3,13.97 114.3,13.34 | 114.94,13.97 116.84,13.97 | 114.3,13.97 114.94,13.97 | 114.94,13.97 114.94,15.24 115.57,15.88 116.2,15.88 116.84,15.24 | 114.3,17.78 116.84,17.78 117.47,17.14 118.11,17.78 118.11,18.41 117.47,19.05 | 114.3,16.51 116.84,16.51 | 114.3,16.51 113.67,16.51 113.03,15.88 113.03,14.61 113.67,13.97
N$53
  Top 0.254: 116.84,13.97 115.57,15.24 113.67,13.34 113.03,13.97 113.67,14.61 114.94,13.34
N$54
  Top 0.254: 114.3,15.88 114.3,15.24 | 114.3,17.14 114.3,15.88 | 114.3,17.14 114.3,19.68 | 114.3,19.68 114.3,20.32 | 114.94,19.68 116.84,19.68 | 114.3,19.68 114.94,19.68 | 114.94,19.68 114.94,18.41 115.57,17.78 116.2,17.78 116.84,18.41 | 114.3,15.88 116.84,15.88 117.47,16.51 118.11,15.88 118.11,15.24 117.47,14.61 | 114.3,17.14 116.84,17.14 | 114.3,17.14 113.67,17.14 113.03,17.78 113.03,19.05 113.67,19.68
N$55
  Top 0.254: D4.C D3.C
N$56  (via drill 0.6)
  Top 0.254: C8.2 IC3.1 52.7,58.42 52.7,53.98 52.07,53.34 50.8,53.34 46.35,48.9 v40.01,48.9 | IC9.14 71.75,34.29 71.12,33.66 39.37,33.66 38.73,34.29 IC7.11
  Bottom 0.254: v40.01,48.9 40.01,38.1 38.73,36.83 IC7.11
N$57
  Bottom 0.254: R30.1 66.67,48.9 C54.-
N$58
  Top 1.016: IC1.5 arc90 103.5,55.25 arc-90 106.05,52.71 106.05,50.16 | 106.05,50.16 IC5.IN | C15.- 106.05,50.16
N$59
  Top 1.016: SW.2 arc90 96.52,75.56 96.52,71.12 | 96.52,71.12 96.52,70.48 arc90 D2.A | 96.52,71.12 D1.C
N$60
  Bottom 0.254: R31.1 74.3,48.9 C55.-
N$61
  Top 0.254: IC3.6 IC3.7
N$62
  Bottom 0.254: IC13.2 66.67,8.89 69.22,11.43 IC13.14
N$63
  Top 0.254: C14.2 R12.1 36.2,59.69 R8.2 IC2.7
N$64
  Top 0.254: C23.1 36.2,43.82 R24.1
N$65
  Bottom 0.254: R32.1 76.83,43.82 C24.1
N$66
  Top 0.254: C1.+ 9.53,81.28 R1.S
N$67
  Top 0.254: R30.2 R31.2 R32.2
  Bottom 0.254: IC9.15 R30.2
N$69
  Bottom 0.254: R22.1 6.99,42.55 5.08,44.45 5.08,57.79 J4.4
N$70  (via drill 0.6)
  Top 0.254: IC2.6 R12.2 C14.1 | IC9.13 74.3,36.83 75.56,38.1 75.56,41.28 73.03,43.82 43.81,43.82 v42.55,45.09
  Bottom 0.254: v42.55,45.09 42.55,52.07 41.27,53.34 34.93,53.34 C14.1
N$72
  Bottom 0.254: R16.1 9.53,53.34 9.53,73.66 C1.-
N$73
  Top 0.254: J4.5 8.89,62.23 R7.1
N$74
  Bottom 0.254: IC12.2 41.27,6.35 43.81,8.89 IC12.14
N$75
  Bottom 0.254: IC12.4 46.35,6.35 50.16,10.16 50.16,13.97 50.8,14.61 52.07,14.61 53.98,16.51 53.98,39.37 52.7,40.64 R28.1
RES1_CV  (via drill 0.6)
  Top 0.254: C21.1 18.41,44.45 R22.2 17.14,42.55 14.61,40.01 14.61,34.92 15.88,33.66 v37.47,33.66
  Bottom 0.254: v37.47,33.66 37.47,31.75 38.73,30.48 IC7.6
RES2_CV  (via drill 0.6)
  Top 0.254: 18.41,63.5 R7.2 | C6.1 18.41,62.23 18.41,63.5 | IC9.3 71.75,29.21 71.12,29.84 v61.59,29.84 | v58.42,49.53 55.88,52.07 55.88,60.33 52.7,63.5 18.41,63.5
  Bottom 0.254: v58.42,49.53 59.05,48.9 59.05,32.38 v61.59,29.84
VCC  (via drill 0.6)
  Top 0.508: 27.3,10.16 12.07,10.16 arc-90 C49.1
  Top 0.61: 36.2,10.16 61.59,10.16 | 61.59,10.16 103.5,10.16 | C49.1 IC11.16 | IC12.16 C50.1 36.2,10.16 | 36.2,10.16 27.3,10.16 IC11.10 | 61.59,10.16 C51.1 IC13.16 | 13.34,32.38 arc-90 4.45,39.37 4.45,44.45 arc-90 J5.2 | 13.34,32.38 v26.04,32.38 v56.52,32.38 v66.67,32.38 v89.53,32.38 v100.97,32.38 100.97,45.09 arc90 97.16,48.9 arc-90 93.34,52.71 93.34,67.31 arc90 87,72.39 v76.83,72.39 62.87,72.39 arc90 60.33,69.85 arc-90 57.78,67.31 v56.52,67.31 v26.04,67.31 | v100.97,29.84 100.97,26.67 arc90 102.23,25.4 arc-113 C43.1 | C31.1 IC6.8 13.34,32.38 | IC10.8 C33.1 | C5.1 IC3.8 | v76.83,69.85 76.83,59.69 | 76.83,59.69 76.83,52.07 78.11,50.8 79.38,50.8 80.64,49.53 C20.1 | 76.83,59.69 IC4.8
  Top 1.016: IC14.OUT 103.5,10.16 C48.+ C43.1
  Bottom 0.61: v100.97,29.84 v100.97,32.38 | v26.04,32.38 IC7.16 C27.1 | v66.67,32.38 IC9.16 C26.1 | v89.53,32.38 IC10.8 | IC2.8 C4.1 v26.04,67.31 | v56.52,67.31 C5.1 | v76.83,72.39 v76.83,69.85 | v56.52,32.38 56.52,29.21 IC8.4 55.24,27.3 C35.1
VEE  (via drill 0.6)
  Top 0.254: R25.2 41.27,41.28 C28.2
  Top 0.61: v99.69,31.11 v99.69,11.43 | v24.13,31.11 v43.81,31.11 v55.24,31.11 v84.45,31.11 v97.16,31.11 v99.69,31.11 | v99.69,31.11 103.5,31.11 | IC10.4 C42.2 | C40.2 IC6.4 | v99.69,8.89 arc-90 92.08,1.27 84.45,1.27 | 84.45,1.27 79.38,1.27 | 79.38,1.27 59.05,1.27 | 59.05,1.27 C52.2 | 79.38,1.27 IC13.7 | 84.45,1.27 C53.2 | IC12.7 53.98,3.81 arc90 55.24,2.54 55.88,2.54 arc-90 56.52,1.91 arc90 57.15,1.27 59.05,1.27 | 87,71.12 arc-90 92.08,67.31 92.08,52.07 arc90 96.83,47.62 arc-90 99.69,44.45 v99.69,33.66 | 87,71.12 74.3,71.12 | 74.3,71.12 64.14,71.12 | v23.5,66.04 v53.98,66.04 59.05,66.04 arc90 61.59,68.58 arc-90 64.14,71.12 | v53.98,59.69 53.98,52.07 | 53.98,52.07 C18.2 | 53.98,52.07 IC3.4 | 74.3,71.12 74.3,52.07 | 74.3,52.07 74.3,50.8 C19.2 | 74.3,52.07 IC4.4 | 87,71.12 R6.1 | IC7.9 C28.2 | IC9.9 87,38.1 C29.2 | 64.14,71.12 R3.1 | C38.2 55.24,36.2 IC8.11
  Top 1.016: C37.2 103.5,31.11 C36.- IC5.OUT
  Bottom 0.61: v99.69,11.43 v99.69,8.89 | IC6.4 arc-90 v24.13,31.11 | v43.81,31.11 IC7.9 | v84.45,31.11 IC9.9 | v97.16,31.11 IC10.4 | v99.69,31.11 v99.69,33.66 | v23.5,66.04 23.5,52.07 | 23.5,52.07 C17.2 | 23.5,52.07 IC2.4 | v53.98,66.04 v53.98,59.69 | v55.24,31.11 IC8.11

### Text on the board
tPlace: Shruthi-1 | Mutable instruments | CV1> | CV2> | Q> | F> | VCA> | OSC> | GND | +5V | RX> | EN> | CLK> | SER> | GND | +5V
tNames: Dual SVF board v0.1 | IN | OUT | Range 1 | V/Oct 1 | Range 2 | V/Oct 2 | 2>VCA | HP2 | LP2 | 1> | HP1 | LP1 | BP2 | 2> | BP1 | 1>VCA